# Altium schematic sheet [02] - Block_Diagram.SchDoc
size A4; DocumentNumber: 2; SheetNumber: 2; SheetTotal: 14
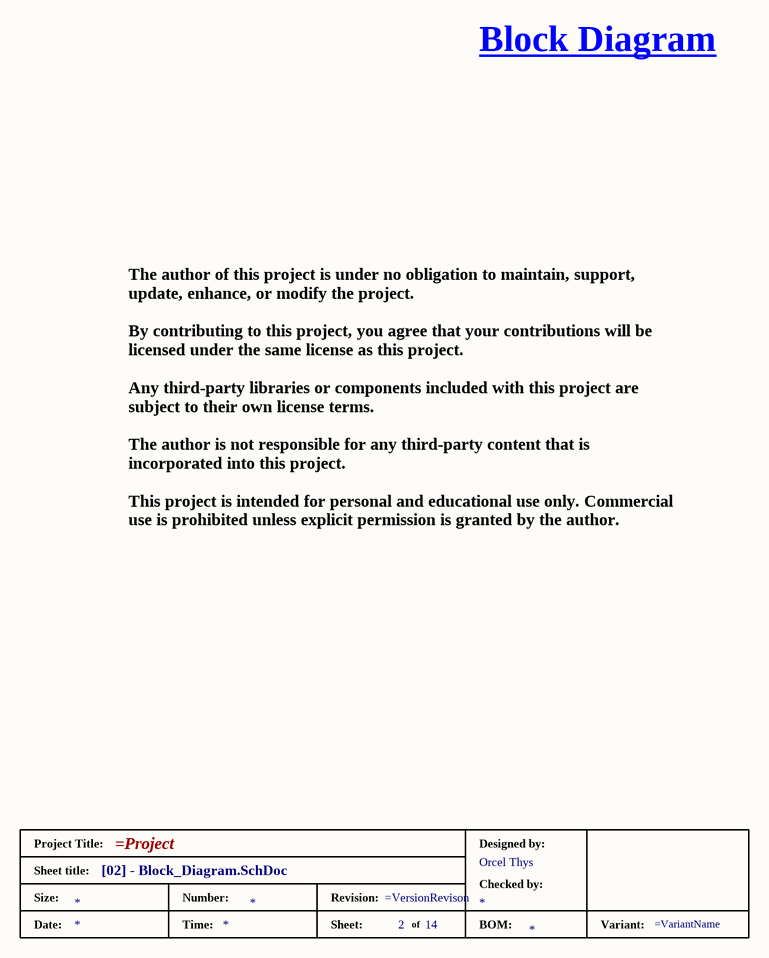
[diagram p0: [02] - Block_Diagram.SchDoc]

## Parts
*  DesignedBy: Orcel Thys  (hidden comment: Standard Title Block)  (graphical)

## Notes on the sheet
- Block Diagram
- The author of this project is under no obligation to maintain, support, update, enhance, or modify the project.
  By contributing to this project, you agree that your contributions will be licensed under the same license as this project.
  Any third-party libraries or components included with this project are subject to their own license terms.
  The author is not responsible for any third-party content that is incorporated into this project.
  This project is intended for personal and educational use only. Commercial use is prohibited unless explicit permission is granted by the author.
- Title
- Size:
- Date:
- A4
- Number:
- Time:
- Revision:
- Sheet
- of
- File:
- (in symbol Title_Block) Project Title:; Designed by:; Sheet title:; Checked by:; Size:; Number:; Revision:; Date:; Time:; Sheet:; of; BOM:; Variant:

## Library data of the parts
* = Title_Block: Size: *; BOM: *; DW: *; CheckedBy: *